# Altium project ANA PROJE.PrjPcb
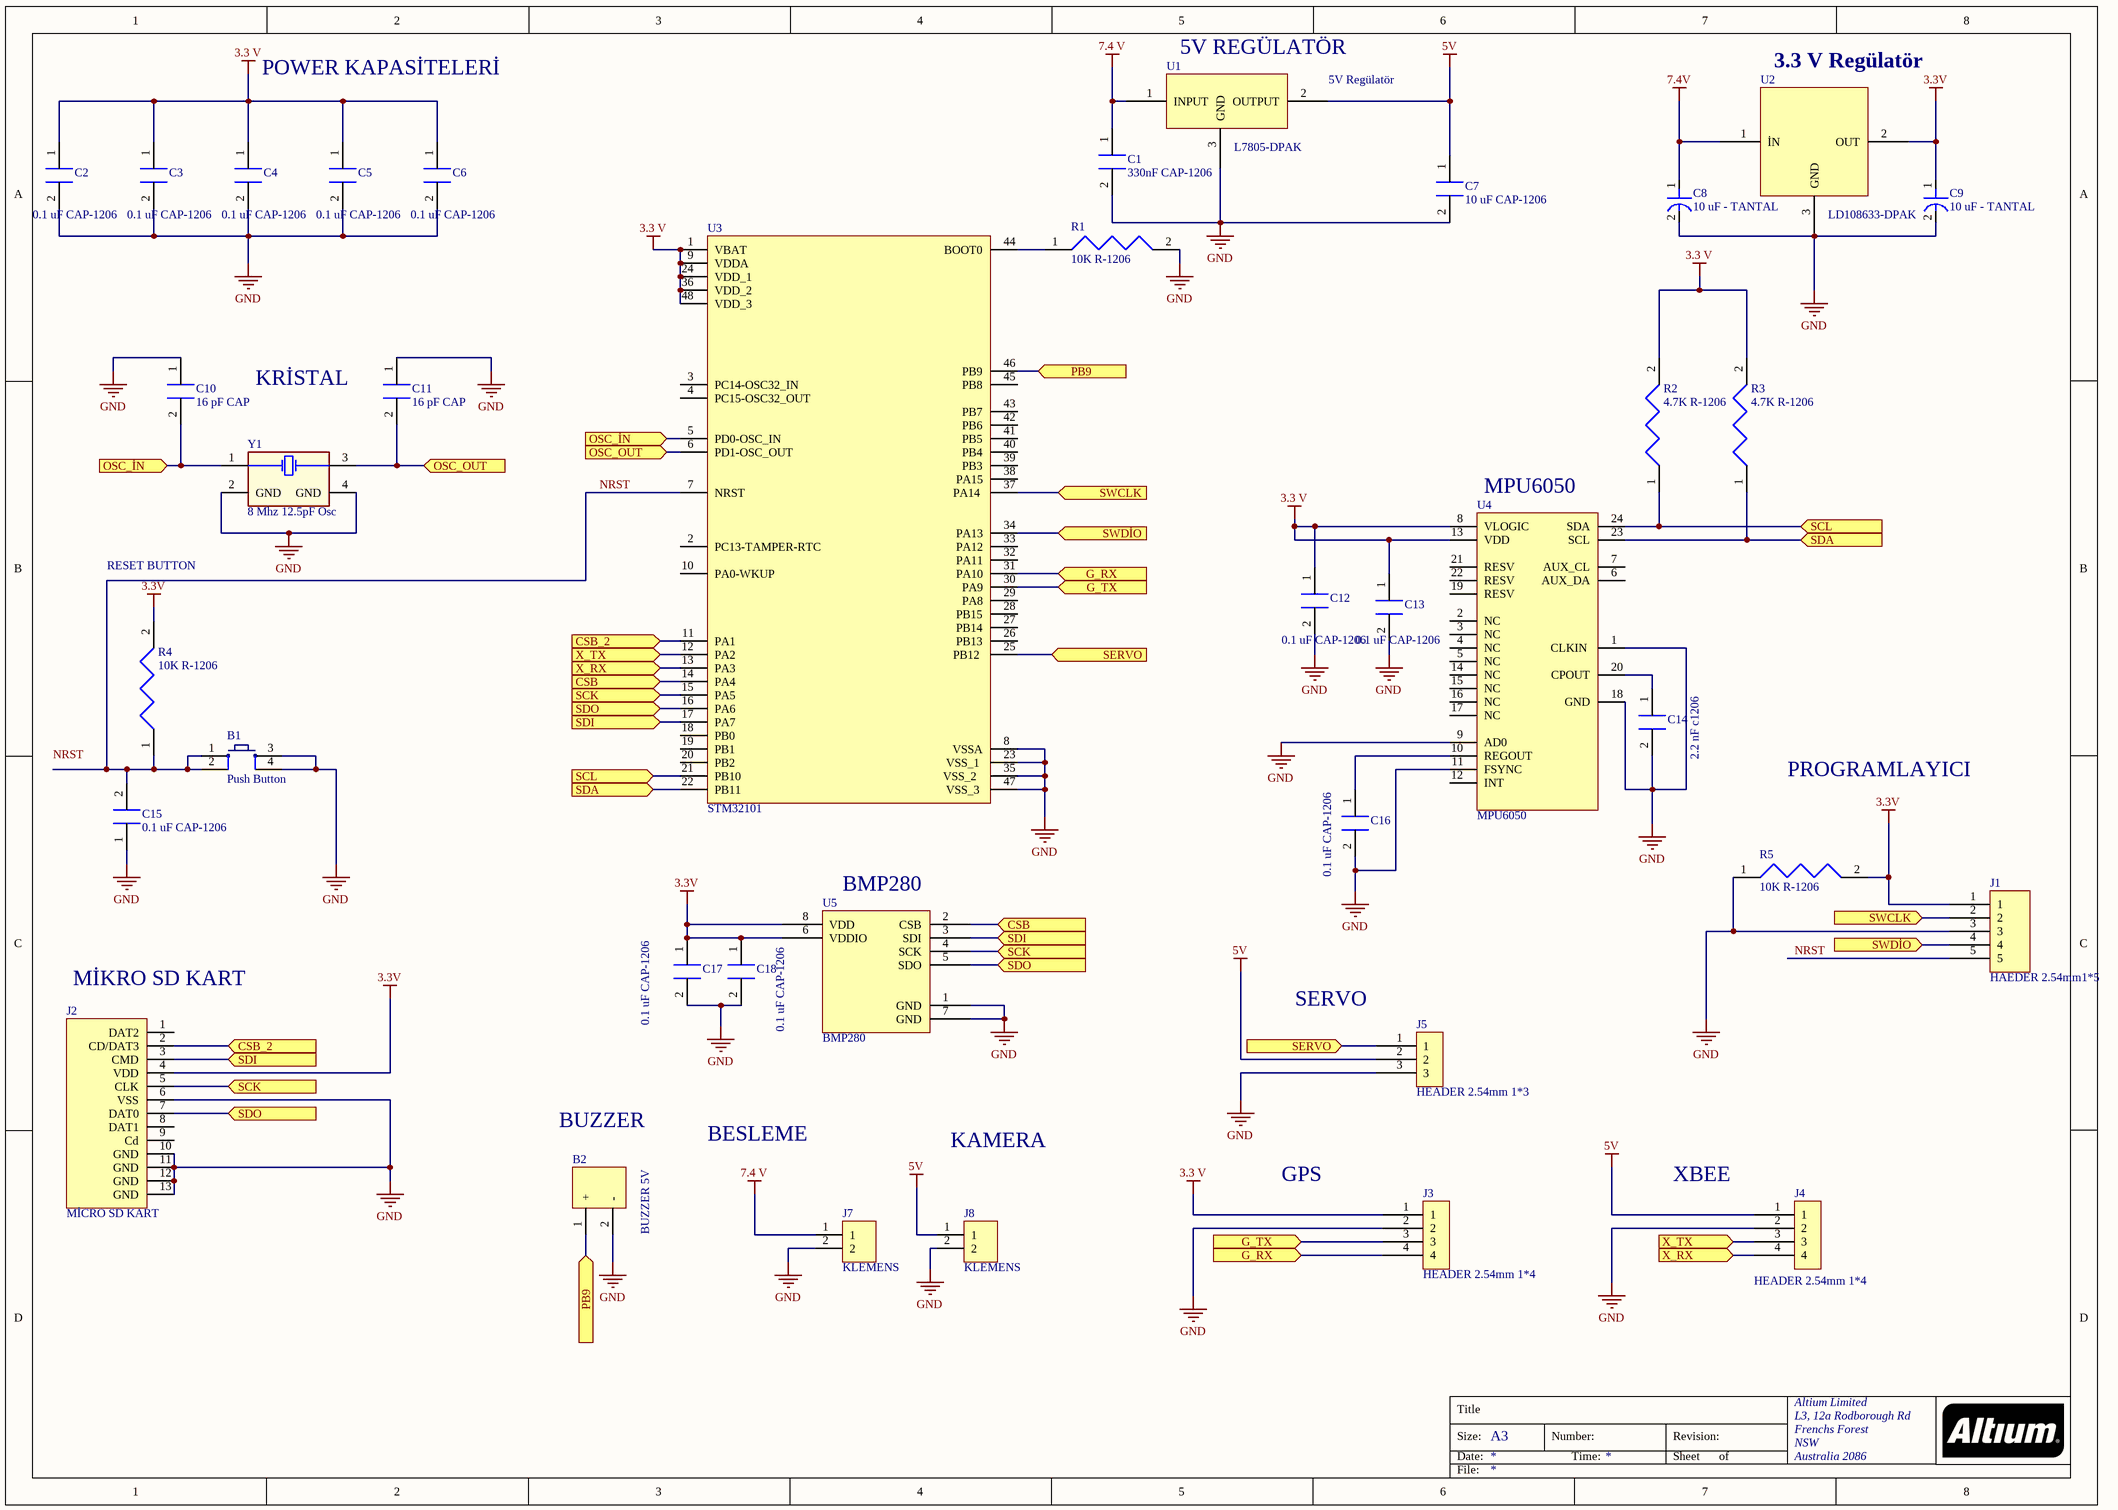
[diagram p0: ŞEMATİK1.SchDoc]
1 sheet, 38 parts. Net scope: flat (ports and power ports of the same name join across sheets).
Board file: PCB.PcbDoc

## Sheet ŞEMATİK1.SchDoc
size A3; Organization: Altium Limited; Address1: L3, 12a Rodborough Rd; Address2: Frenchs Forest; Address3: NSW; Address4: Australia 2086

### Parts
B1  Push Button  [PUSH BUTTON]
B2  BUZZER 5V  [BUZZER]
C1  330nF CAP-1206  [CAP-1206]
C2  0.1 uF CAP-1206  [CAP-1206]
C3  0.1 uF CAP-1206  [CAP-1206]
C4  0.1 uF CAP-1206  [CAP-1206]
C5  0.1 uF CAP-1206  [CAP-1206]
C6  0.1 uF CAP-1206  [CAP-1206]
C7  10 uF CAP-1206  [CAP-1206]
C8  10 uF - TANTAL  [CAP-1206 TANTAL]
C9  10 uF - TANTAL  [CAP-1206 TANTAL]
C10  16 pF CAP  [16pF CAP]
C11  16 pF CAP  [16pF CAP]
C12  0.1 uF CAP-1206  [CAP-1206]
C13  0.1 uF CAP-1206  [CAP-1206]
C14  2.2 nF c1206  [CAP-1206]
C15  0.1 uF CAP-1206  [CAP-1206]
C16  0.1 uF CAP-1206  [CAP-1206]
C17  0.1 uF CAP-1206  [CAP-1206]
C18  0.1 uF CAP-1206  [CAP-1206]
J1  HAEDER 2.54mm1*5  [FEMALE HEADER 1*5 2.54 MM]
J2  MİCRO SD KART  [MİCRO SD KART]
J3  HEADER 2.54mm 1*4  [FEMALE HEADER 1*4 2.54MM]
J4  HEADER 2.54mm 1*4  [FEMALE HEADER 1*4 2.54MM]
J5  HEADER 2.54mm 1*3  [FEMALE HEADER 1*3 2.54MM]
J7  KLEMENS  [KLEMENS 1*2 / 3.5mm]
J8  KLEMENS  [KLEMENS 1*2 / 3.5mm]
R1  10K R-1206  [RES 1206]
R2  4.7K R-1206  [RES 1206]
R3  4.7K R-1206  [RES 1206]
R4  10K R-1206  [RES 1206]
R5  10K R-1206  [RES 1206]
U1  L7805-DPAK  [DPAKL7805 REGULATOR]
U2  LD108633-DPAK  [DPAKL7805 REGULATOR]
U3  STM32101  [FQP48]
U4  MPU6050  [MPU6050-QFN]
U5  BMP280  [BMP-280]
Y1  8 Mhz 12.5pF Osc  [8 Mhz 12.5pF OSC]

### Ports
CSB (in), CSB_2 (in), G_RX (in), G_TX (in), OSC_İN (in), OSC_OUT (in), PB9 (in), SCK (in), SCL (in), SDA (in), SDI (in), SDO (in), SERVO (in), SWCLK (in), SWDİO (in), X_RX (in), X_TX (in)

### Nets
3.3 V: C2.1 C3.1 C4.1 C5.1 C6.1 C12.1 C13.1 J3.1 R2.2 R3.2 U3.1(VBAT) U3.9(VDDA) U3.24(VDD_1) U3.36(VDD_2) U3.48(VDD_3) U4.8(VLOGIC) U4.13(VDD)
3.3V: C9.1 C17.1 C18.1 J1.1 J2.4(VDD) R4.2 R5.2 U2.2(OUT) U5.6(VDDIO) U5.8(VDD)
5V: C7.1 J4.1 J5.2 J8.1 U1.2(OUTPUT)
7.4 V: C1.1 J7.1 U1.1(INPUT)
7.4V: C8.1 U2.1(İN)
GND: B1.3 B1.4 B2.2(-) C1.2 C2.2 C3.2 C4.2 C5.2 C6.2 C7.2 C8.2 C9.2 C10.1 C11.1 C12.2 C13.2 C14.2 C15.1 C16.2 C17.2 C18.2 J1.3 J2.6(VSS) J2.10(GND) J2.11(GND) J2.12(GND) J2.13(GND) J3.2 J4.2 J5.3 J7.2 J8.2 R1.2 R5.1 U1.3(GND) U2.3(GND) U3.8(VSSA) U3.23(VSS_1) U3.35(VSS_2) U3.47(VSS_3) U4.1(CLKIN) U4.9(AD0) U4.11(FSYNC) U4.18(GND) U5.1(GND) U5.7(GND) Y1.2(GND) Y1.4(GND)
NRST: B1.1 B1.2 C15.2 J1.5 R4.1 U3.7(NRST)
NetB2_1: B2.1(+) U3.46(PB9) ; port PB9
NetC10_2: C10.2 U3.5(PD0-OSC_IN) Y1.1 ; port OSC_İN
NetC11_2: C11.2 U3.6(PD1-OSC_OUT) Y1.3 ; port OSC_OUT
NetC14_1: C14.1 U4.20(CPOUT)
NetC16_1: C16.1 U4.10(REGOUT)
NetJ1_2: J1.2 U3.37(PA14) ; port SWCLK
NetJ1_4: J1.4 U3.34(PA13) ; port SWDİO
NetJ2_2: J2.2(CD/DAT3) U3.11(PA1) ; port CSB_2
NetJ2_3: J2.3(CMD) U3.17(PA7) U5.3(SDI) ; port SDI
NetJ2_5: J2.5(CLK) U3.15(PA5) U5.4(SCK) ; port SCK
NetJ2_7: J2.7(DAT0) U3.16(PA6) U5.5(SDO) ; port SDO
NetJ3_3: J3.3 U3.30(PA9) ; port G_TX
NetJ3_4: J3.4 U3.31(PA10) ; port G_RX
NetJ4_3: J4.3 U3.12(PA2) ; port X_TX
NetJ4_4: J4.4 U3.13(PA3) ; port X_RX
NetJ5_1: J5.1 U3.25(PB12) ; port SERVO
NetR1_1: R1.1 U3.44(BOOT0)
NetR2_1: R2.1 U3.21(PB10) U4.24(SDA) ; port SCL
NetR3_1: R3.1 U3.22(PB11) U4.23(SCL) ; port SDA
NetU3_14: U3.14(PA4) U5.2(CSB) ; port CSB

Not connected (* = marked no-connect by the designer): J2 1(DAT2) 8(DAT1) 9(Cd); U3 2(PC13-TAMPER-RTC) 3(PC14-OSC32_IN) 4(PC15-OSC32_OUT) 10(PA0-WKUP) 18(PB0) 19(PB1) 20(PB2) 26(PB13) 27(PB14) 28(PB15) 29(PA8) 32(PA11) 33(PA12) 38(PA15) 39(PB3) 40(PB4) 41(PB5) 42(PB6) 43(PB7) 45(PB8); U4 2(NC) 3(NC) 4(NC) 5(NC) 6(AUX_DA) 7(AUX_CL) 12(INT) 14(NC) 15(NC) 16(NC) 17(NC) 19(RESV) 21(RESV) 22(RESV)

### Notes on the sheet
- POWER KAPASİTELERİ
- (near U1) 5V REGÜLATÖR
- (near U1) 5V Regülatör
- 3.3 V Regülatör
- KRİSTAL
- (near U4) MPU6050
- RESET BUTTON
- PROGRAMLAYICI
- (near U5) BMP280
- (near J2) MİKRO SD KART
- SERVO
- BUZZER
- BESLEME
- KAMERA
- GPS
- XBEE
- Labels drawn without touching a wire or pin: NRST
- Title
- Size:
- Date:
- A3
- Number:
- Time:
- Revision:
- Sheet
- of
- File:

### Library data of the parts
B1 = Push Button: Smd Push Button; Satın Alma Linki: https://urun.n11.com/diger/mini-pushbutton-switch-smd-P227461537?gclid=Cj0KCQjwkoDmBRCcARIsAG3xzl8Y_-jeD7HocNM6lvuZ_rVp83568XPGtNzlPwXWLph8oCRqo0yh87UaApZYEALw_wcB&gclsrc=aw.ds
B2 = BUZZER 5V: 1*2
C1 = 330nF CAP-1206: 330nF 1206
C2-C6 C12 C13 C15-C18 = 0.1 uF CAP-1206: 0.1 uF 1206
C8 C9 = 10 uF - TANTAL: KUTUPLU
C10 C11 = 16 pF CAP: 16pF Capasitör
J1 = HAEDER 2.54mm1*5: 5 PİNLİ
J2 = MİCRO SD KART: SD HOLDER
J3 J4 = HEADER 2.54mm 1*4: 4 PİNLİ
J5 = HEADER 2.54mm 1*3: 3 PİNLİ
J7 J8 = KLEMENS: 1*2/ 3.5MM
U1 = L7805-DPAK: 5V REGÜLATÖR DPAK
U2 = LD108633-DPAK: 3.3V  REGÜLATÖR
U3 = STM32101: STM32F48 101 İŞLEMCİ; ComponentLink1Description: New link; ComponentLink1URL: *; ComponentLink2Description: New link; ComponentLink2URL: *; ComponentLink3Description: New link; ComponentLink3URL: *
U4 = MPU6050: QFNP 6*6 İŞLEMCİ
U5 = BMP280: BMP280 SENSOR